# Altium project Switch_PCB.PrjPCB
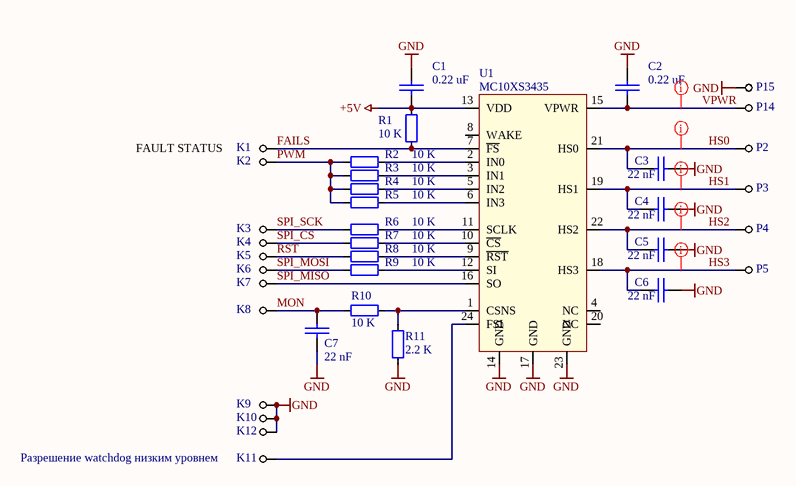
[diagram p0: Sheet2.SchDoc]
1 sheet, 37 parts. Net scope: global (net labels, ports and power ports of the same name join across sheets).
Board file: SWITCH_PCB.PcbDoc

## Sheet Sheet2.SchDoc
size A4

### Parts
C1  value 0.22 uF  [2012[0805]]  (hidden comment: C0805C224K5RACTU)
C2  value 0.22 uF  [2012[0805]]  (hidden comment: C0805C224K5RACTU)
C3  value 22 nF  [1608[0603]]  (hidden comment: CL10B223KB8NNNC)
C4  value 22 nF  [1608[0603]]  (hidden comment: CL10B223KB8NNNC)
C5  value 22 nF  [1608[0603]]  (hidden comment: CL10B223KB8NNNC)
C6  value 22 nF  [1608[0603]]  (hidden comment: CL10B223KB8NNNC)
C7  value 22 nF  [1608[0603]]  (hidden comment: CL10B223KB8NNNC)
K1  Pin 0.7 mm  [Mount hole 0.7 mm]  (value not drawn)  (net tie, no BOM)
K2  Pin 0.7 mm  [Mount hole 0.7 mm]  (value not drawn)  (net tie, no BOM)
K3  Pin 0.7 mm  [Mount hole 0.7 mm]  (value not drawn)  (net tie, no BOM)
K4  Pin 0.7 mm  [Mount hole 0.7 mm]  (value not drawn)  (net tie, no BOM)
K5  Pin 0.7 mm  [Mount hole 0.7 mm]  (value not drawn)  (net tie, no BOM)
K6  Pin 0.7 mm  [Mount hole 0.7 mm]  (value not drawn)  (net tie, no BOM)
K7  Pin 0.7 mm  [Mount hole 0.7 mm]  (value not drawn)  (net tie, no BOM)
K8  Pin 0.7 mm  [Mount hole 0.7 mm]  (value not drawn)  (net tie, no BOM)
K9  Pin 0.7 mm  [Mount hole 0.7 mm]  (value not drawn)  (net tie, no BOM)
K10  Pin 0.7 mm  [Mount hole 0.7 mm]  (value not drawn)  (net tie, no BOM)
K11  Pin 0.7 mm  [Mount hole 0.7 mm]  (value not drawn)  (net tie, no BOM)
K12  Pin 0.7 mm  [Mount hole 0.7 mm]  (value not drawn)  (net tie, no BOM)
P2  Pin 0.7 mm  [Mount hole 0.7 mm]  (value not drawn)  (net tie, no BOM)
P3  Pin 0.7 mm  [Mount hole 0.7 mm]  (value not drawn)  (net tie, no BOM)
P4  Pin 0.7 mm  [Mount hole 0.7 mm]  (value not drawn)  (net tie, no BOM)
P5  Pin 0.7 mm  [Mount hole 0.7 mm]  (value not drawn)  (net tie, no BOM)
P14  Pin 0.7 mm  [Mount hole 0.7 mm]  (value not drawn)  (net tie, no BOM)
P15  Pin 0.7 mm  [Mount hole 0.7 mm]  (value not drawn)  (net tie, no BOM)
R1  value 10 K  [0603]  (hidden comment: ERJ-3EKF1002V)
R2  value 10 K  [0603]  (hidden comment: ERJ-3EKF1002V)
R3  value 10 K  [0603]  (hidden comment: ERJ-3EKF1002V)
R4  value 10 K  [0603]  (hidden comment: ERJ-3EKF1002V)
R5  value 10 K  [0603]  (hidden comment: ERJ-3EKF1002V)
R6  value 10 K  [0603]  (hidden comment: ERJ-3EKF1002V)
R7  value 10 K  [0603]  (hidden comment: ERJ-3EKF1002V)
R8  value 10 K  [0603]  (hidden comment: ERJ-3EKF1002V)
R9  value 10 K  [0603]  (hidden comment: ERJ-3EKF1002V)
R10  value 10 K  [0603]  (hidden comment: ERJ-3EKF1002V)
R11  value 2.2 K  [0603]  (hidden comment: RC0603FR-072K2L)
U1  MC10XS3435  [24-PIN PQFN (12*12)]

### Nets
+5V: C1.2 R1.1 U1.13(VDD)
GND: C1.1 C2.1 C3.2 C4.2 C5.2 C6.2 C7.2 K9.1 K10.1 K12.1 P15.1 R11.2 U1.14(GND) U1.17(GND) U1.23(GND)
FAILS: K1.1 R1.2 U1.7(~{FS})
HS0: C3.1 P2.1 U1.21(HS0)
HS1: C4.1 P3.1 U1.19(HS1)
HS2: C5.1 P4.1 U1.22(HS2)
HS3: C6.1 P5.1 U1.18(HS3)
MON: C7.1 K8.1 R10.2
PWM: K2.1 R2.2 R3.2 R4.2 R5.2
RST: K5.1 R8.2
SPI_CS: K4.1 R7.2
SPI_MISO: K7.1 U1.16(SO)
SPI_MOSI: K6.1 R9.2
SPI_SCK: K3.1 R6.2
VPWR: C2.2 P14.1 U1.15(VPWR)
NetK11_1: K11.1 U1.24(FSI)
NetR2_1: R2.1 U1.2(IN0)
NetR3_1: R3.1 U1.3(IN1)
NetR4_1: R4.1 U1.5(IN2)
NetR5_1: R5.1 U1.6(IN3)
NetR6_1: R6.1 U1.11(SCLK)
NetR7_1: R7.1 U1.10(~{CS})
NetR8_1: R8.1 U1.9(~{RST})
NetR9_1: R9.1 U1.12(SI)
NetR10_1: R10.1 R11.1 U1.1(CSNS)

Not connected (* = marked no-connect by the designer): U1 4(NC) 8(WAKE) 20(NC)

### Layout directives
net class 24V: HS0, HS1, HS2, HS3, VPWR

### Notes on the sheet
- FAULT STATUS
- Разрешение watchdog низким уровнем

### Library data of the parts
C1 C2 = C0805C224K5RACTU: 0.22 uF, 50V, X7R,  0805; Manufacturer: Kemet; PartNum: 399-3491-1-ND; Tolerance: +-10%; Distributor: Digi-Key; Price: 0.1$; Voltage: 50 V
C3-C7 = CL10B223KB8NNNC: 22 nF, 50V, 10%, X7R, 0603 SMD MLC Capacitor; Manufacturer: SAMSUNG; PartNum: CL10B102KB8NNNC; Tolerance: 10%; Distributor: Digi-Key; Price: 0.002$; Voltage: 50 V; PartName: CL10B223KB8NNNC
R1-R10 = RL0603K010-1_1: 10 K, 1%, 0603, SMD Resistor, Taped; Manufacturer: PANASONIC; Voltage: 75 V; Distributor: Future; Price: 0.0015 Euro; Tolerance: 1%; PartNum: ERJ-3EKF1002V; PartName: ERJ-3EKF1002V; Price50: 0.0015 Euro; Price100: 0.0015 Euro; Price1000: 0.0015 Euro
R11 = RL0603K002.2-1_1: 2.2 K, 1%, 0603, SMD Resistor, Taped; Manufacturer: YAGEO AMERICA CORPORATION; Voltage: 75 V; Distributor: Future; Price: 0.0017$; Tolerance: 1%; PartNum: RC0603FR-072K2L; PartName: RC0603FR-072K2L; Price50: 0.0017$; Price100: 0.0017$; Price1000: 0.0017$
U1 = MC10XS3435: Quad High-side Switch, -40..+125C, 24 PQFN; Manufacturer: Freescale; Distributor: Freescale; PartNum: MC10XS3435; PartName: MC10XS3435
K1-K12 P2-P5 P14 P15 = Pin 0.7 mm: PartName: Pin 0.7 mm